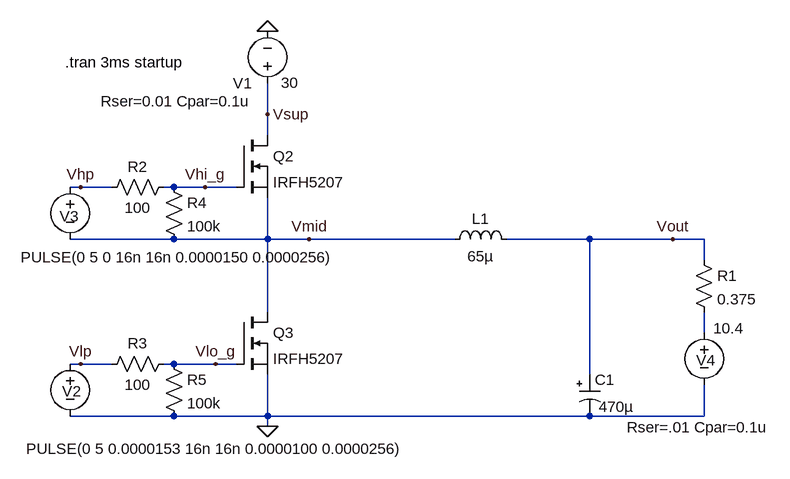
[diagram p0: schematic MOSFET_Heat_Sim_Pulse_IRFH5207_as_NCE8295AK.asc]
MOSFET_Heat_Sim_Pulse_IRFH5207_as_NCE8295AK.asc, the LTspice schematic file:
Version 4
SHEET 1 1472 680
WIRE 240 -176 240 -224
WIRE 240 -144 240 -176
WIRE -48 -64 -64 -64
WIRE 0 -64 -48 -64
WIRE 96 -64 80 -64
WIRE 144 -64 96 -64
WIRE 192 -64 144 -64
WIRE 96 16 -64 16
WIRE 240 16 240 -48
WIRE 240 16 96 16
WIRE 304 16 240 16
WIRE 528 16 304 16
WIRE 736 16 608 16
WIRE 864 16 736 16
WIRE 912 16 864 16
WIRE 912 48 912 16
WIRE 240 128 240 16
WIRE 912 160 912 128
WIRE -48 208 -64 208
WIRE 0 208 -48 208
WIRE 96 208 80 208
WIRE 160 208 96 208
WIRE 192 208 160 208
WIRE 736 224 736 16
WIRE 96 288 -64 288
WIRE 240 288 240 224
WIRE 240 288 96 288
WIRE 736 288 240 288
WIRE 912 288 912 240
WIRE 912 288 736 288
WIRE 240 304 240 288
FLAG 240 304 0
FLAG 240 -304 0
FLAG 864 16 Vout
FLAG 144 -64 Vhi_g
FLAG 160 208 Vlo_g
FLAG 304 16 Vmid
FLAG -48 -64 Vhp
FLAG -48 208 Vlp
FLAG 240 -176 Vsup
SYMBOL res 896 32 R0
SYMATTR InstName R1
SYMATTR Value 0.375
SYMBOL voltage 240 -208 R180
WINDOW 123 0 0 Left 0
WINDOW 39 24 -12 Left 2
WINDOW 3 -48 17 Left 2
SYMATTR SpiceLine Rser=0.01 Cpar=0.1u
SYMATTR Value 30
SYMATTR InstName V1
SYMBOL voltage -64 192 R0
WINDOW 0 -12 58 Left 2
WINDOW 3 -68 146 Left 2
WINDOW 123 0 0 Left 0
WINDOW 39 0 0 Left 0
SYMATTR InstName V2
SYMATTR Value PULSE(0 5 0.0000153 16n 16n 0.0000100 0.0000256)
SYMBOL res 96 -80 R90
WINDOW 0 0 56 VBottom 2
WINDOW 3 32 56 VTop 2
SYMATTR InstName R2
SYMATTR Value 100
SYMBOL res 96 192 R90
WINDOW 0 0 56 VBottom 2
WINDOW 3 32 56 VTop 2
SYMATTR InstName R3
SYMATTR Value 100
SYMBOL res 80 -80 R0
SYMATTR InstName R4
SYMATTR Value 100k
SYMBOL res 80 192 R0
SYMATTR InstName R5
SYMATTR Value 100k
SYMBOL polcap 720 224 R0
WINDOW 3 30 50 Left 2
SYMATTR Value 470µ
SYMATTR InstName C1
SYMATTR Description Capacitor
SYMATTR Type cap
SYMATTR SpiceLine V=100 Irms=1.88 Rser=0.013 Lser=6.47n mfg="Würth Elektronik" pn="860040880011 WCAP-ATUL 16x35,5" type="Al electrolytic"
SYMBOL ind 512 32 R270
WINDOW 0 32 56 VTop 2
WINDOW 3 5 56 VBottom 2
SYMATTR InstName L1
SYMATTR Value 65µ
SYMATTR SpiceLine Ipk=17.2 Rser=0.01313 Rpar=21316 Cpar=20.57p mfg="Würth Elektronik" pn="7443783533650 WE-HCFT 3533"
SYMBOL voltage -64 -80 R0
WINDOW 0 -16 61 Left 2
WINDOW 3 -76 124 Left 2
WINDOW 123 0 0 Left 0
WINDOW 39 0 0 Left 0
SYMATTR InstName V3
SYMATTR Value PULSE(0 5 0 16n 16n 0.0000150 0.0000256)
SYMBOL voltage 912 144 R0
WINDOW 0 -12 58 Left 2
WINDOW 3 14 9 Left 2
WINDOW 123 0 0 Left 0
WINDOW 39 -119 161 Left 2
SYMATTR InstName V4
SYMATTR Value 10.4
SYMATTR SpiceLine Rser=.01 Cpar=0.1u
SYMBOL nmos 192 -144 R0
SYMATTR InstName Q2
SYMATTR Value IRFH5207
SYMBOL nmos 192 128 R0
SYMATTR InstName Q3
SYMATTR Value IRFH5207
TEXT -72 -256 Left 2 !.tran 3ms startup

The netlist it stands for:
* MOSFET_Heat_Sim_Pulse_IRFH5207_as_NCE8295AK.asc
R1 Vout N001 0.375
V1 Vsup 0 30 Rser=0.01 Cpar=0.1u
V2 Vlp 0 PULSE(0 5 0.0000153 16n 16n 0.0000100 0.0000256)
R2 Vhi_g Vhp 100
R3 Vlo_g Vlp 100
R4 Vhi_g Vmid 100k
R5 Vlo_g 0 100k
C1 Vout 0 470µ V=100 Irms=1.88 Rser=0.013 Lser=6.47n mfg="Würth Elektronik" pn="860040880011 WCAP-ATUL 16x35,5" type="Al electrolytic"
L1 Vmid Vout 65µ Ipk=17.2 Rser=0.01313 Rpar=21316 Cpar=20.57p mfg="Würth Elektronik" pn="7443783533650 WE-HCFT 3533"
V3 Vhp Vmid PULSE(0 5 0 16n 16n 0.0000150 0.0000256)
V4 N001 0 10.4 Rser=.01 Cpar=0.1u
M§Q2 Vsup Vhi_g Vmid Vmid IRFH5207
M§Q3 Vmid Vlo_g 0 0 IRFH5207
.model NMOS NMOS
.model PMOS PMOS
.lib standard.mos
.tran 3ms startup
.backanno
.end